# Altium schematic sheet Pedal_LoopLEDS.SchDoc
size A4; SheetNumber: 1; SheetTotal: 1
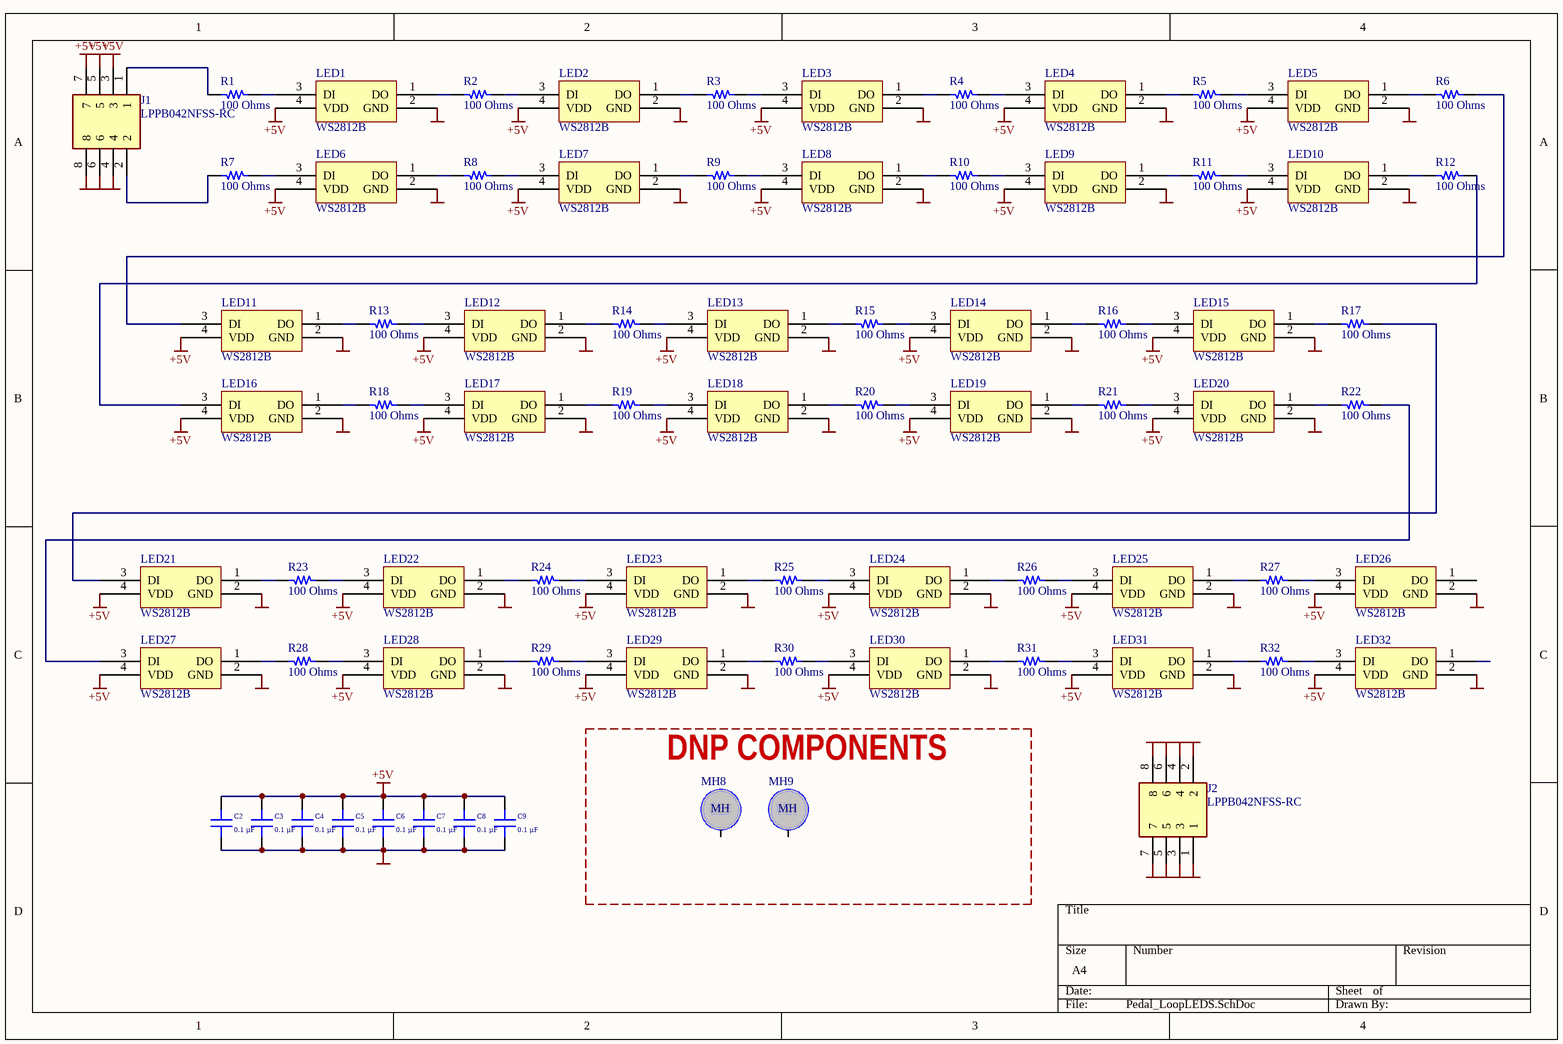
[diagram p0: Pedal_LoopLEDS.SchDoc]

## Parts
C2  0.1 µF  [CAP 0603_1608]
C3  0.1 µF  [CAP 0603_1608]
C4  0.1 µF  [CAP 0603_1608]
C5  0.1 µF  [CAP 0603_1608]
C6  0.1 µF  [CAP 0603_1608]
C7  0.1 µF  [CAP 0603_1608]
C8  0.1 µF  [CAP 0603_1608]
C9  0.1 µF  [CAP 0603_1608]
J1  LPPB042NFSS-RC  [LPPB042NFSSRC]
J2  LPPB042NFSS-RC  [LPPB042NFSSRC]
LED1  WS2812B  [WS2812B_2.2x2mm]
LED2  WS2812B  [WS2812B_2.2x2mm]
LED3  WS2812B  [WS2812B_2.2x2mm]
LED4  WS2812B  [WS2812B_2.2x2mm]
LED5  WS2812B  [WS2812B_2.2x2mm]
LED6  WS2812B  [WS2812B_2.2x2mm]
LED7  WS2812B  [WS2812B_2.2x2mm]
LED8  WS2812B  [WS2812B_2.2x2mm]
LED9  WS2812B  [WS2812B_2.2x2mm]
LED10  WS2812B  [WS2812B_2.2x2mm]
LED11  WS2812B  [WS2812B_2.2x2mm]
LED12  WS2812B  [WS2812B_2.2x2mm]
LED13  WS2812B  [WS2812B_2.2x2mm]
LED14  WS2812B  [WS2812B_2.2x2mm]
LED15  WS2812B  [WS2812B_2.2x2mm]
LED16  WS2812B  [WS2812B_2.2x2mm]
LED17  WS2812B  [WS2812B_2.2x2mm]
LED18  WS2812B  [WS2812B_2.2x2mm]
LED19  WS2812B  [WS2812B_2.2x2mm]
LED20  WS2812B  [WS2812B_2.2x2mm]
LED21  WS2812B  [WS2812B_2.2x2mm]
LED22  WS2812B  [WS2812B_2.2x2mm]
LED23  WS2812B  [WS2812B_2.2x2mm]
LED24  WS2812B  [WS2812B_2.2x2mm]
LED25  WS2812B  [WS2812B_2.2x2mm]
LED26  WS2812B  [WS2812B_2.2x2mm]
LED27  WS2812B  [WS2812B_2.2x2mm]
LED28  WS2812B  [WS2812B_2.2x2mm]
LED29  WS2812B  [WS2812B_2.2x2mm]
LED30  WS2812B  [WS2812B_2.2x2mm]
LED31  WS2812B  [WS2812B_2.2x2mm]
LED32  WS2812B  [WS2812B_2.2x2mm]
MH8  MountingHole  [Hole_2.5mm]  (value not drawn)
MH9  MountingHole  [Hole_2.5mm]  (value not drawn)
R1  100 Ohms  [RES 0402_1005]
R2  100 Ohms  [RES 0402_1005]
R3  100 Ohms  [RES 0402_1005]
R4  100 Ohms  [RES 0402_1005]
R5  100 Ohms  [RES 0402_1005]
R6  100 Ohms  [RES 0402_1005]
R7  100 Ohms  [RES 0402_1005]
R8  100 Ohms  [RES 0402_1005]
R9  100 Ohms  [RES 0402_1005]
R10  100 Ohms  [RES 0402_1005]
R11  100 Ohms  [RES 0402_1005]
R12  100 Ohms  [RES 0402_1005]
R13  100 Ohms  [RES 0402_1005]
R14  100 Ohms  [RES 0402_1005]
R15  100 Ohms  [RES 0402_1005]
R16  100 Ohms  [RES 0402_1005]
R17  100 Ohms  [RES 0402_1005]
R18  100 Ohms  [RES 0402_1005]
R19  100 Ohms  [RES 0402_1005]
R20  100 Ohms  [RES 0402_1005]
R21  100 Ohms  [RES 0402_1005]
R22  100 Ohms  [RES 0402_1005]
R23  100 Ohms  [RES 0402_1005]
R24  100 Ohms  [RES 0402_1005]
R25  100 Ohms  [RES 0402_1005]
R26  100 Ohms  [RES 0402_1005]
R27  100 Ohms  [RES 0402_1005]
R28  100 Ohms  [RES 0402_1005]
R29  100 Ohms  [RES 0402_1005]
R30  100 Ohms  [RES 0402_1005]
R31  100 Ohms  [RES 0402_1005]
R32  100 Ohms  [RES 0402_1005]

## Blocks framed on the sheet
DNP COMPONENTS: MH8 MH9

## Nets
+5V: C2.2 C3.2 C4.2 C5.2 C6.2 C7.2 C8.2 C9.2 J1.3 J1.5 J1.7 LED1.4(VDD) LED2.4(VDD) LED3.4(VDD) LED4.4(VDD) LED5.4(VDD) LED6.4(VDD) LED7.4(VDD) LED8.4(VDD) LED9.4(VDD) LED10.4(VDD) LED11.4(VDD) LED12.4(VDD) LED13.4(VDD) LED14.4(VDD) LED15.4(VDD) LED16.4(VDD) LED17.4(VDD) LED18.4(VDD) LED19.4(VDD) LED20.4(VDD) LED21.4(VDD) LED22.4(VDD) LED23.4(VDD) LED24.4(VDD) LED25.4(VDD) LED26.4(VDD) LED27.4(VDD) LED28.4(VDD) LED29.4(VDD) LED30.4(VDD) LED31.4(VDD) LED32.4(VDD)
GND: C2.1 C3.1 C4.1 C5.1 C6.1 C7.1 C8.1 C9.1 J1.4 J1.6 J1.8 J2.1 J2.2 J2.3 J2.4 J2.5 J2.6 J2.7 J2.8 LED1.2(GND) LED2.2(GND) LED3.2(GND) LED4.2(GND) LED5.2(GND) LED6.2(GND) LED7.2(GND) LED8.2(GND) LED9.2(GND) LED10.2(GND) LED11.2(GND) LED12.2(GND) LED13.2(GND) LED14.2(GND) LED15.2(GND) LED16.2(GND) LED17.2(GND) LED18.2(GND) LED19.2(GND) LED20.2(GND) LED21.2(GND) LED22.2(GND) LED23.2(GND) LED24.2(GND) LED25.2(GND) LED26.2(GND) LED27.2(GND) LED28.2(GND) LED29.2(GND) LED30.2(GND) LED31.2(GND) LED32.2(GND)
NetJ1_1: J1.1 R1.2
NetJ1_2: J1.2 R7.2
NetLED1_1: LED1.1(DO) R2.2
NetLED1_3: LED1.3(DI) R1.1
NetLED2_1: LED2.1(DO) R3.2
NetLED2_3: LED2.3(DI) R2.1
NetLED3_1: LED3.1(DO) R4.2
NetLED3_3: LED3.3(DI) R3.1
NetLED4_1: LED4.1(DO) R5.2
NetLED4_3: LED4.3(DI) R4.1
NetLED5_1: LED5.1(DO) R6.2
NetLED5_3: LED5.3(DI) R5.1
NetLED6_1: LED6.1(DO) R8.2
NetLED6_3: LED6.3(DI) R7.1
NetLED7_1: LED7.1(DO) R9.2
NetLED7_3: LED7.3(DI) R8.1
NetLED8_1: LED8.1(DO) R10.2
NetLED8_3: LED8.3(DI) R9.1
NetLED9_1: LED9.1(DO) R11.2
NetLED9_3: LED9.3(DI) R10.1
NetLED10_1: LED10.1(DO) R12.2
NetLED10_3: LED10.3(DI) R11.1
NetLED11_1: LED11.1(DO) R13.2
NetLED11_3: LED11.3(DI) R6.1
NetLED12_1: LED12.1(DO) R14.2
NetLED12_3: LED12.3(DI) R13.1
NetLED13_1: LED13.1(DO) R15.2
NetLED13_3: LED13.3(DI) R14.1
NetLED14_1: LED14.1(DO) R16.2
NetLED14_3: LED14.3(DI) R15.1
NetLED15_1: LED15.1(DO) R17.2
NetLED15_3: LED15.3(DI) R16.1
NetLED16_1: LED16.1(DO) R18.2
NetLED16_3: LED16.3(DI) R12.1
NetLED17_1: LED17.1(DO) R19.2
NetLED17_3: LED17.3(DI) R18.1
NetLED18_1: LED18.1(DO) R20.2
NetLED18_3: LED18.3(DI) R19.1
NetLED19_1: LED19.1(DO) R21.2
NetLED19_3: LED19.3(DI) R20.1
NetLED20_1: LED20.1(DO) R22.2
NetLED20_3: LED20.3(DI) R21.1
NetLED21_1: LED21.1(DO) R23.2
NetLED21_3: LED21.3(DI) R17.1
NetLED22_1: LED22.1(DO) R24.2
NetLED22_3: LED22.3(DI) R23.1
NetLED23_1: LED23.1(DO) R25.2
NetLED23_3: LED23.3(DI) R24.1
NetLED24_1: LED24.1(DO) R26.2
NetLED24_3: LED24.3(DI) R25.1
NetLED25_1: LED25.1(DO) R27.2
NetLED25_3: LED25.3(DI) R26.1
NetLED26_3: LED26.3(DI) R27.1
NetLED27_1: LED27.1(DO) R28.2
NetLED27_3: LED27.3(DI) R22.1
NetLED28_1: LED28.1(DO) R29.2
NetLED28_3: LED28.3(DI) R28.1
NetLED29_1: LED29.1(DO) R30.2
NetLED29_3: LED29.3(DI) R29.1
NetLED30_1: LED30.1(DO) R31.2
NetLED30_3: LED30.3(DI) R30.1
NetLED31_1: LED31.1(DO) R32.2
NetLED31_3: LED31.3(DI) R31.1
NetLED32_3: LED32.3(DI) R32.1

Not connected (* = marked no-connect by the designer): LED26 1(DO); LED32 1(DO); MH8 0; MH9 0

## Notes on the sheet
- (in symbol MountingHole) MH

## Library data of the parts
C2-C9 = C0603C104K5RAC7411: CAP CER 0.1UF 50V X7R 0603; manufacturer: KEMET; Tolerance: ±10%; Part Number: C0603C104K5RAC7411; Value: 0.1 µF; Applications: Bypass, Decoupling; Capacitance: 0.1 µF; componentlink1description: Datasheet; componentlink1url: https://api.kemet.com/component-edge/download/datasheet/C0603C104K5RAC7411.pdf; componentlink2description: DigiKey Link; componentlink2url: https://www.digikey.com/en/products/detail/kemet/C0603C104K5RAC7411/3317013; Device Package: 0603 (1608 Metric); lastupdated: 2/9/2024 8:10:30 PM; Lifecycle Status: Active; Minimum Order: 1; Mounting Type: Surface Mount, MLCC; Operating Temperature: -55°C ~ 125°C; Package / Case: 0603 (1608 Metric); packaging: TapeAndReel; partid: 2233; Part Status: Active; price: 0.01; series: SMD Comm X7R; Size / Dimension: 0.063" L x 0.031" W (1.60mm x 0.80mm); Supplier 1: DigiKey; Supplier Part Number 1: 399-C0603C104K5RAC7411CT-ND; Temperature Coefficient: X7R; Thickness (Max): 0.035" (0.90mm); Voltage - Rated: 50V
J1 J2 = LPPB042NFSS-RC: Connector; Manufacturer_Name: Sullins; Datasheet Link: https://www.sullinscorp.com/drawings/88_LPPB___2NFSS-RC,_11017.pdf; Height: 4.65mm; Manufacturer_Part_Number: LPPB042NFSS-RC
  J1: System: Connector
LED1-LED32 = WS2812B: Address LED
R1-R32 = CRCW0402100RFKEE: RES SMD 100 OHM 1% 1/16W 0402; Manufacturer: Vishay Dale; Power (Watts): 0.063W, 1/16W; Temperature Coefficient: ±100ppm/°C; Part Number: CRCW0402100RFKEE; Value: 100 Ohms; ComponentLink1Description: Datasheet; ComponentLink1URL: http://www.vishay.com/docs/20035/dcrcwe3.pdf; ComponentLink2Description: DigiKey Link; ComponentLink2URL: https://www.digikey.com/en/products/detail/vishay-dale/CRCW0402100RFKEE/5069886; Composition: Thick Film; Device Package: 0402 (1005 Metric); Height - Seated (Max): 0.016" (0.40mm); LastUpdated: 2/9/2024 8:30:05 PM; Lifecycle Status: Active; Minimum Order: 1; Number of Terminations: 2; Operating Temperature: -55°C ~ 155°C; Package / Case: 0402 (1005 Metric); Packaging: CutTape; PartId: 6830; Part Status: Active; Price: 0.01; Resistance: 100 Ohms; Series: CRCW; Size / Dimension: 0.039" L x 0.020" W (1.00mm x 0.50mm); Supplier 1: DigiKey; Supplier Part Number 1: 541-2953-1-ND; Supplier Device Package: 0402; Tolerance: ±1%; Features: Automotive AEC-Q200; Ratings: AEC-Q200